# EAGLE schematic supercap-backup (EAGLE 9.5.2)
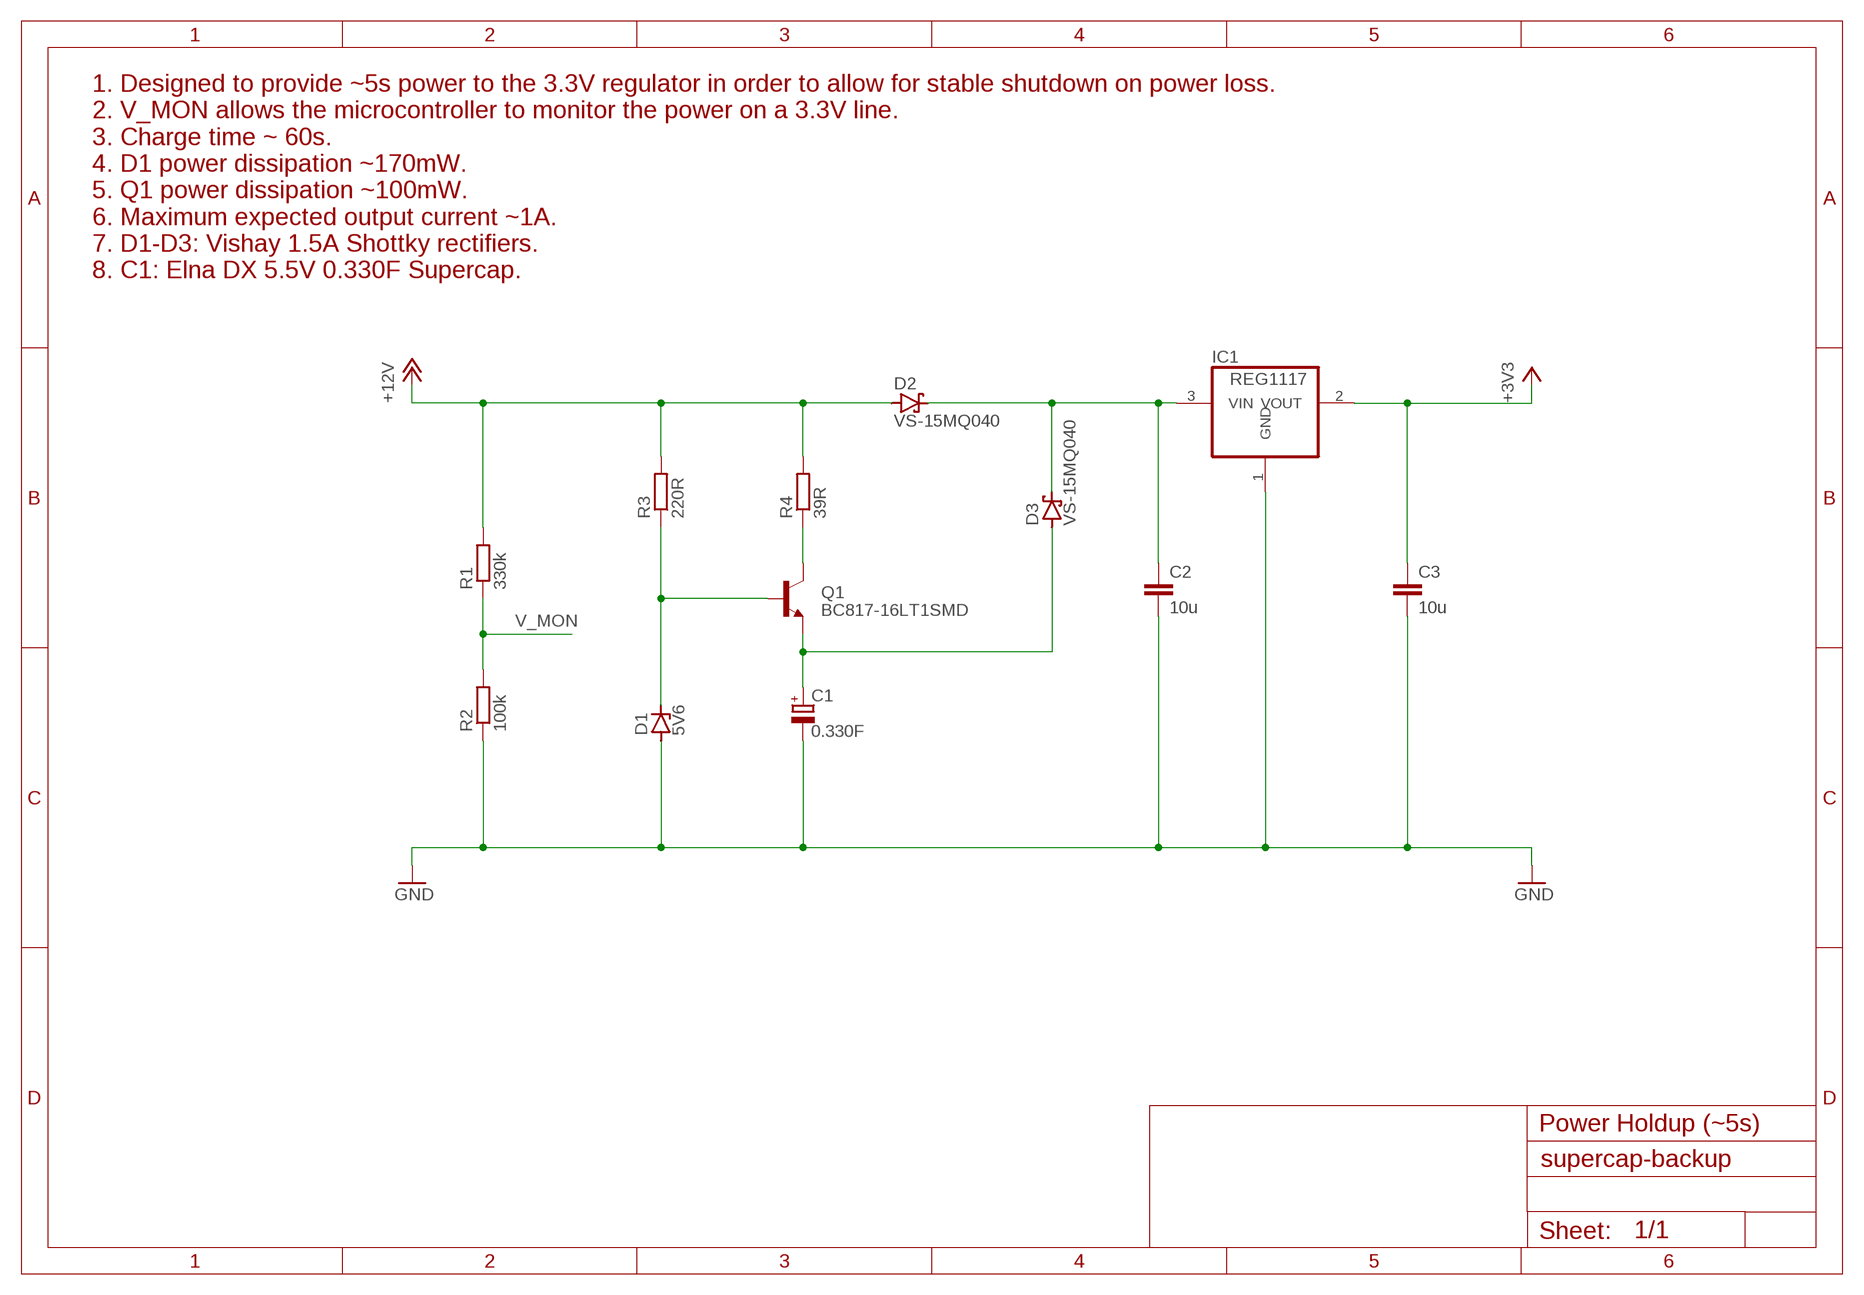
[diagram p0: schematic, sheet 1]

## Parts
C1  0.330F  CPOL-EUE3.5-10  [E3,5-10]
C2  10u  C-EU050-024X044  [C050-024X044]
C3  10u  C-EU050-024X044  [C050-024X044]
D1  5V6  ZENER-DIODEZD-10  [ZDIO-10]
D2  VS-15MQ040  SCHOTTKY-DIODEC4111-15  [C4111-15]
D3  VS-15MQ040  SCHOTTKY-DIODEC4111-15  [C4111-15]
IC1  REG1117  [SOT223]
Q1  BC817-16LT1SMD  [SOT23-BEC]
R1  330k  R-EU_0207/10  [0207/10]
R2  100k  R-EU_0207/10  [0207/10]
R3  220R  R-EU_0207/10  [0207/10]
R4  39R  R-EU_0207/10  [0207/10]

## Nets
+3V3: C3.1 IC1.2(VOUT)
+12V: D2.A R1.2 R3.2 R4.2
GND: C1.- C2.2 C3.2 D1.A IC1.1(GND) R2.1
N$1: C2.1 D2.C D3.C IC1.3(VIN)
N$6: D1.C Q1.B R3.1
N$8: Q1.C R4.1
N$9: C1.+ D3.A Q1.E
V_MON: R1.1 R2.2

## Notes on the sheet
- 1. Designed to provide ~5s power to the 3.3V regulator in order to allow for stable shutdown on power loss.
  2. V_MON allows the microcontroller to monitor the power on a 3.3V line.
  3. Charge time ~ 60s.
  4. D1 power dissipation ~170mW.
  5. Q1 power dissipation ~100mW.
  6. Maximum expected output current ~1A.
  7. D1-D3: Vishay 1.5A Shottky rectifiers.
  8. C1: Elna DX 5.5V 0.330F Supercap.
- Power Holdup (~5s)

## Library data of the parts
C1 = rcl:CPOL-EU: POLARIZED CAPACITOR, European symbol; SPICEPREFIX: C
C2 C3 = rcl:C-EU: CAPACITOR, European symbol; SPICEPREFIX: C
D1 = diode:ZENER-DIODE: Z-Diode
D2 D3 = diode:SCHOTTKY-DIODE: Schottky Diode
IC1 = burr-brown:REG1117: 800mA and 1A Low Dropout (LDO) Positive Regulator 1.8V, 2.5V, 2.85V, 3.3V, 5V, and Adj; MPN: REG1117; OC_FARNELL: 1097566; OC_NEWARK: 14P6981
Q1 = transistor-npn:BC817*: NPN Transistor
R1-R4 = rcl:R-EU_: RESISTOR, European symbol; SPICEPREFIX: R